# Altium schematic sheet MotorX.SchDoc: 智能电机驱动器
size A4
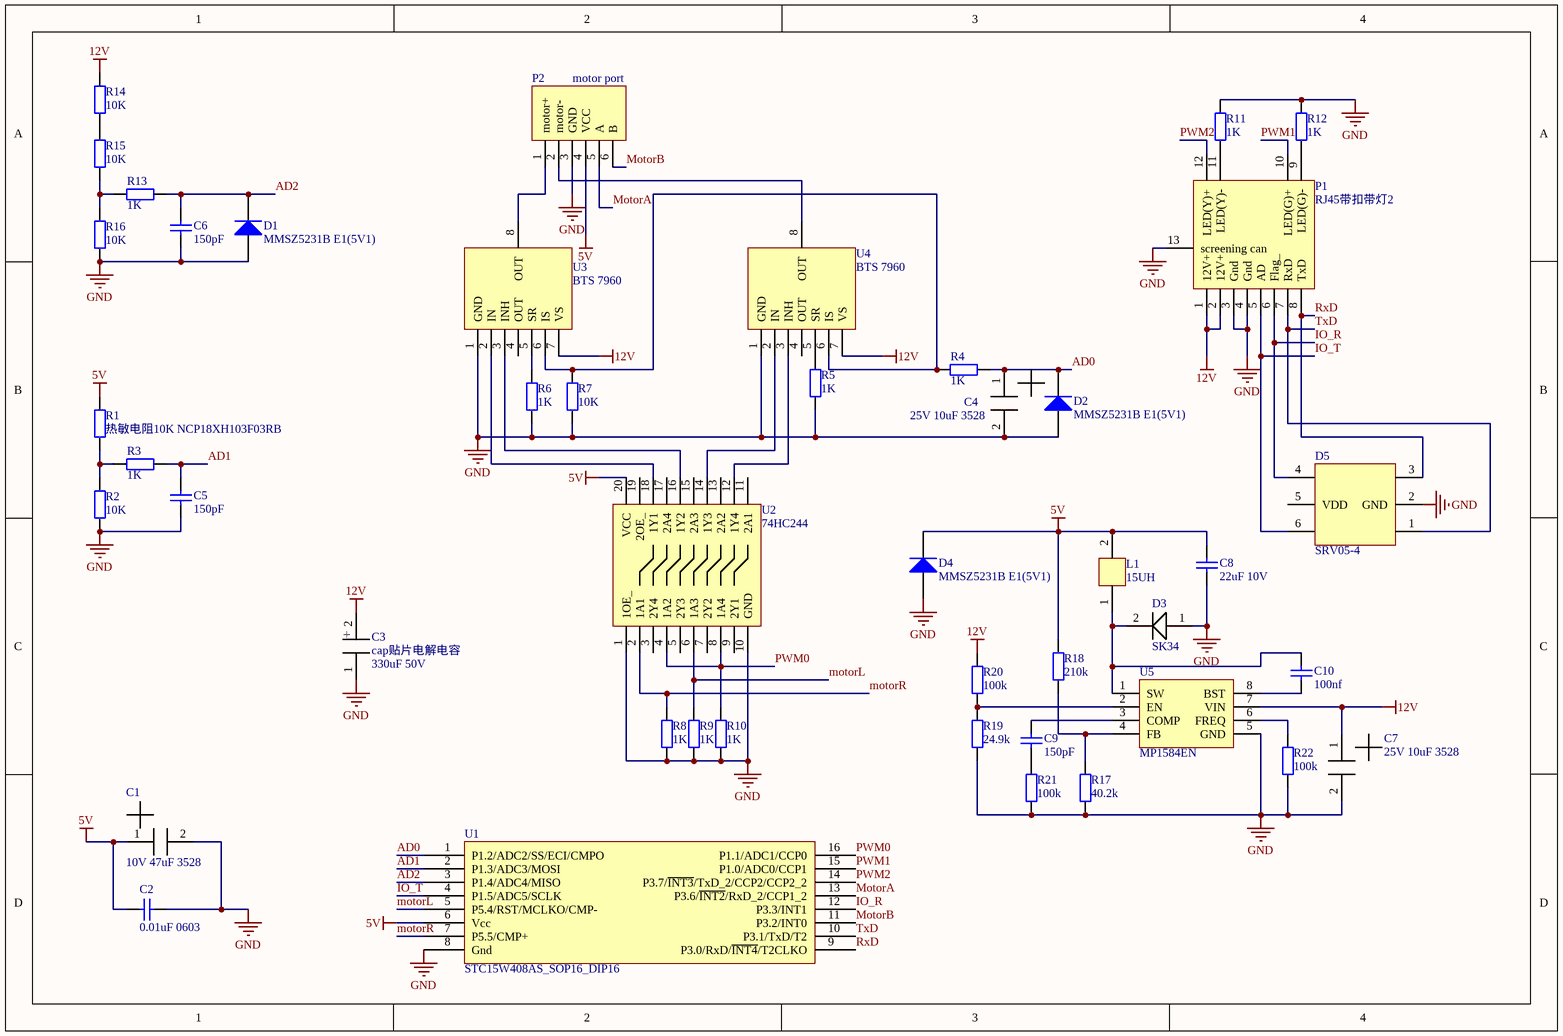
[diagram p0: MotorX.SchDoc]

## Parts
C1  10V 47uF 3528  [贴片电容3528_2]
C2  0.01uF 0603  [0603]
C3  cap贴片电解电容  [贴片电解电容（10*10.2mm）]
C4  25V 10uF 3528  [贴片电容3528_2]
C5  value 150pF  [0603]  (hidden comment: Cap)
C6  value 150pF  [0603]  (hidden comment: Cap)
C7  25V 10uF 3528  [贴片电容3528_2]
C8  value 22uF 10V  [0805]  (hidden comment: Cap)
C9  value 150pF  [0603]  (hidden comment: Cap)
C10  value 100nf  [0603]  (hidden comment: Cap)
D1  MMSZ5231B E1(5V1)  [SOD-123_5]
D2  MMSZ5231B E1(5V1)  [SOD-123_5]
D3  SK34  [SK34]
D4  MMSZ5231B E1(5V1)  [SOD-123_5]
D5  SRV05-4  [sot-23-6(SRV05-4)]
L1  15UH  [0630功率电感]
P1  RJ45带扣带灯2  [RJ45带扣带灯_2]
P2  motor port  [2.54排针]
R1  value 热敏电阻10K NCP18XH103F03RB  [0603]  (hidden comment: Res)
R2  value 10K  [0603]  (hidden comment: Res)
R3  value 1K  [0603]  (hidden comment: Res)
R4  value 1K  [0603]  (hidden comment: Res)
R5  value 1K  [0603]  (hidden comment: Res)
R6  value 1K  [0603]  (hidden comment: Res)
R7  value 10K  [0603]  (hidden comment: Res)
R8  value 1K  [0603]  (hidden comment: Res)
R9  value 1K  [0603]  (hidden comment: Res)
R10  value 1K  [0603]  (hidden comment: Res)
R11  value 1K  [0603]  (hidden comment: Res)
R12  value 1K  [0603]  (hidden comment: Res)
R13  value 1K  [0603]  (hidden comment: Res)
R14  value 10K  [0603]  (hidden comment: Res)
R15  value 10K  [0603]  (hidden comment: Res)
R16  value 10K  [0603]  (hidden comment: Res)
R17  value 40.2k  [0603]  (hidden comment: Res)
R18  value 210k  [0603]  (hidden comment: Res)
R19  value 24.9k  [0603]  (hidden comment: Res)
R20  value 100k  [0603]  (hidden comment: Res)
R21  value 100k  [0603]  (hidden comment: Res)
R22  value 100k  [0603]  (hidden comment: Res)
U1  STC15W408AS_SOP16_DIP16  [SOP16]
U2  74HC244  [TSSOP-20]
U3  BTS 7960  [TO-263-7]
U4  BTS 7960  [TO-263-7]
U5  MP1584EN  [MP1584EN]

## Nets
5V: C1.1 C2.1 C8.2 D4.2(K) L1.2 P2.4(VCC) R1.2 R18.2 U1.6(Vcc) U2.20(VCC)
12V: C3.2 C7.1 P1.1(12V+) P1.2(12V+) R14.2 R20.2 U3.7(VS) U4.7(VS) U5.7(VIN)
GND: C1.2 C2.2 C3.1 C4.2 C5.1 C6.1 C7.2 C8.1 D1.1(A) D2.1(A) D3.1 D4.1(A) D5.2(GND) P1.3(Gnd) P1.4(Gnd) P1.13(screening_can) P2.3(GND) R2.1 R5.1 R6.1 R7.1 R8.1 R9.1 R10.1 R11.2 R12.2 R16.1 R17.1 R19.1 R21.1 R22.1 U1.8(Gnd) U2.1(1OE_) U2.10(GND) U3.1(GND) U4.1(GND) U5.5(GND)
AD0: C4.1 D2.2(K) R4.2 U1.1(P1.2/ADC2/SS/ECI/CMPO)
AD1: C5.2 R3.2 U1.2(P1.3/ADC3/MOSI)
AD2: C6.2 D1.2(K) R13.2 U1.3(P1.4/ADC4/MISO)
IO_R: D5.4 P1.6(Flag_) U1.12(P3.3/INT1)
IO_T: D5.6 P1.5(AD) U1.4(P1.5/ADC5/SCLK)
MotorA: P2.5(A) U1.13(P3.6/~{INT2}/RxD_2/CCP1_2)
MotorB: P2.6(B) U1.11(P3.2/INT0)
motorL: R9.2 U1.5(P5.4/RST/MCLKO/CMP-) U2.6(1A3)
motorR: R8.2 U1.7(P5.5/CMP+) U2.2(1A1)
PWM0: R10.2 U1.16(P1.1/ADC1/CCP0) U2.4(1A2) U2.8(1A4)
PWM1: P1.10(LED(G)+) U1.15(P1.0/ADC0/CCP1)
PWM2: P1.12(LED(Y)+) U1.14(P3.7/~{INT3}/TxD_2/CCP2/CCP2_2)
RxD: D5.3 P1.8(TxD) U1.9(P3.0/RxD/~{INT4}/T2CLKO)
TxD: D5.1 P1.7(RxD) U1.10(P3.1/TxD/T2)
NetC9_1: C9.1 R21.2
NetC9_2: C9.2 U5.3(COMP)
NetC10_1: C10.1 U5.8(BST)
NetC10_2: C10.2 D3.2 L1.1 U5.1(SW)
NetP1_9: P1.9(LED(G)-) R12.1
NetP1_11: P1.11(LED(Y)-) R11.1
NetP2_1: P2.1(motor+) U3.8(OUT)
NetP2_2: P2.2(motor-) U4.8(OUT)
NetR1_1: R1.1 R2.2 R3.1
NetR4_1: R4.1 R7.2 U3.6(IS) U4.6(IS)
NetR5_2: R5.2 U4.5(SR)
NetR6_2: R6.2 U3.5(SR)
NetR13_1: R13.1 R15.1 R16.2
NetR14_1: R14.1 R15.2
NetR17_2: R17.2 R18.1 U5.4(FB)
NetR19_2: R19.2 R20.1 U5.2(EN)
NetR22_2: R22.2 U5.6(FREQ)
NetU2_12: U2.12(1Y4) U4.3(INH)
NetU2_14: U2.14(1Y3) U4.2(IN)
NetU2_16: U2.16(1Y2) U3.3(INH)
NetU2_18: U2.18(1Y1) U3.2(IN)

Not connected (* = marked no-connect by the designer): D5 5(VDD); U2 3(2Y4) 5(2Y3) 7(2Y2) 9(2Y1) 11(2A1) 13(2A2) 15(2A3) 17(2A4) 19(2OE_); U3 4(OUT); U4 4(OUT)

## Notes on the sheet
- (in symbol cap贴片电容) +; 330uF 50V

## Library data of the parts
C1 C4 C7 = 电容
C2 C5 C6 C8-C10 = Cap: Capacitor; Published: 8-Jun-2000; LatestRevisionDate: 17-Jul-2002; LatestRevisionNote: Re-released for DXP Platform.; PackageReference: RAD-0.3; Publisher: Altium Limited
  C2: PackageDescription: Radial Cap, Thru-Hole; 2 Leads; 0.3 in Pin Spacing
C3 = cap贴片电容
D1 D2 D4 = Diode 1N4148: High Conductance Fast Diode; Published: 8-Jun-2000; LatestRevisionDate: 17-Jul-2002; LatestRevisionNote: Re-released for DXP Platform.; DatasheetVersion: 1997; PackageReference: DO-35; Publisher: Altium Limited; Code_JEDEC: DO-204-AH; ComponentLink1Description: Manufacturer Link; ComponentLink1URL: http://www.fairchildsemi.com/; ComponentLink2Description: Datasheet; ComponentLink2URL: http://www.fairchildsemi.com/ds/1N%2F1N4148.pdf
L1 = 0630功率电感
R1-R22 = Res2: Resistor; Published: 8-Jun-2000; LatestRevisionDate: 17-Jul-2002; LatestRevisionNote: Re-released for DXP Platform.; PackageReference: AXIAL-0.4; Publisher: Altium Limited
U1 = STC15W401AS_SOP16_DIP16
U5 = Component_1